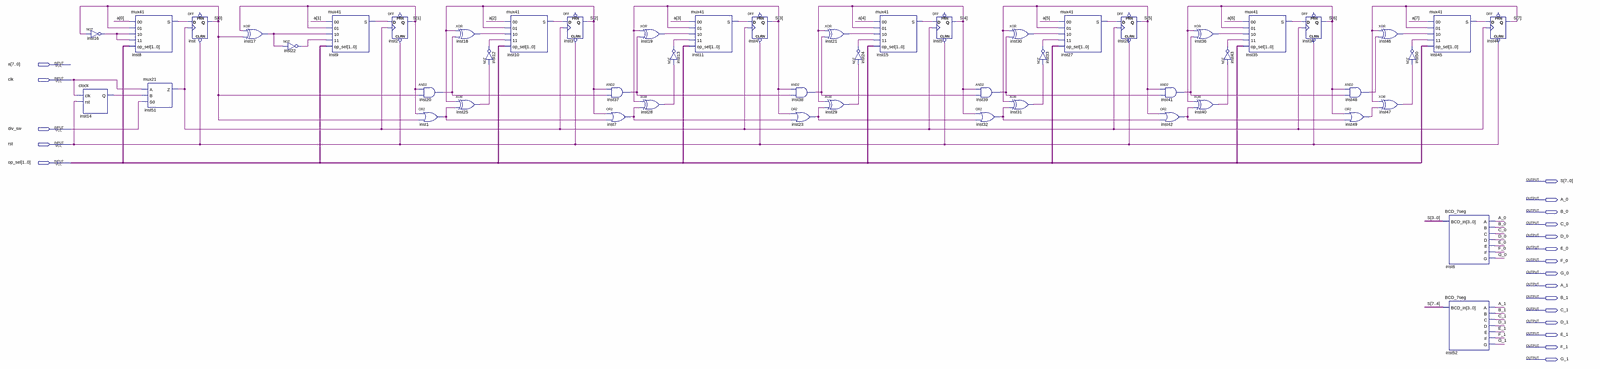
[diagram p0: schematic sheet, whole]
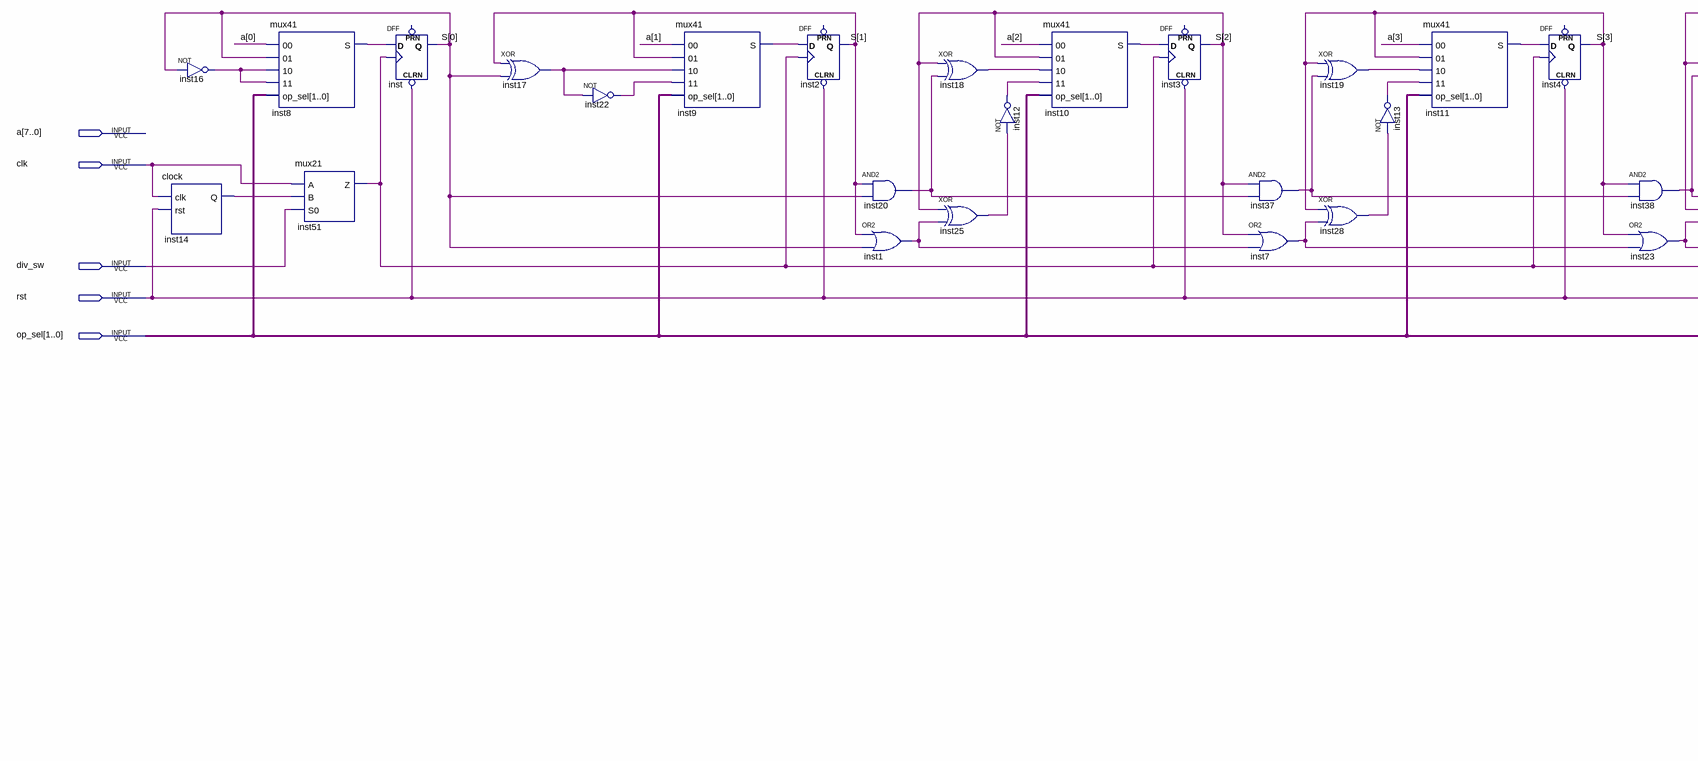
[diagram p1: schematic sheet, left part]
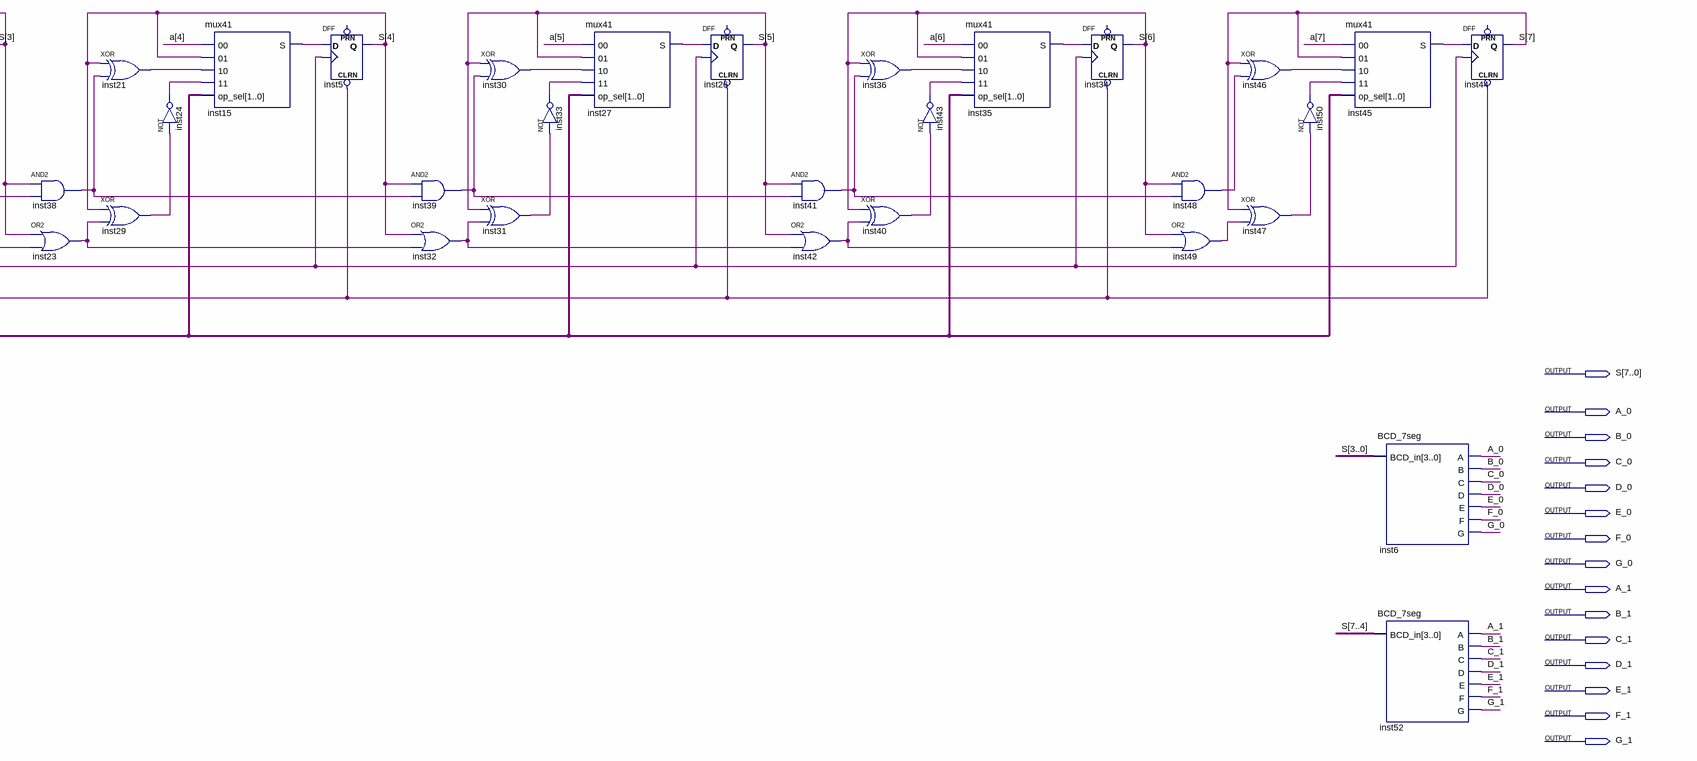
[diagram p2: schematic sheet, right part]
// Quartus schematic counter.bdf as structural Verilog: 53 symbols, 20 pins
module counter (
  input  [7:0] a,
  input  clk,
  input  div_sw,
  input  rst,
  input  [1:0] op_sel,
  output [7:0] S,
  output A_0,
  output B_0,
  output C_0,
  output D_0,
  output E_0,
  output F_0,
  output G_0,
  output A_1,
  output B_1,
  output C_1,
  output D_1,
  output E_1,
  output F_1,
  output G_1
);

  wire inst1_out, inst7_out, inst8_s, inst9_s, inst10_s, inst11_s, inst12_out, inst13_out, inst14_q,
       inst15_s, inst16_out, inst17_out, inst18_out, inst19_out, inst20_out, inst21_out, inst22_out,
       inst23_out, inst24_out, inst25_out, inst27_s, inst28_out, inst29_out, inst30_out, inst31_out,
       inst32_out, inst33_out, inst35_s, inst36_out, inst37_out, inst38_out, inst39_out, inst40_out,
       inst41_out, inst42_out, inst43_out, inst45_s, inst46_out, inst47_out, inst48_out, inst49_out,
       inst50_out, inst51_z;

  not inst16 (inst16_out, S[0]);
  clock inst14 (.clk(clk), .rst(rst), .Q(inst14_q));
  mux41 inst8 (.\00 (a[0]), .\01 (S[0]), .\10 (inst16_out), .\11 (inst16_out), .op_sel(op_sel), .S(inst8_s));
  mux21 inst51 (.A(clk), .B(inst14_q), .S0(div_sw), .Z(inst51_z));
  DFF inst (.CLRN(rst), .CLK(inst51_z), .D(inst8_s), .Q(S[0]));  // open: PRN
  xor inst17 (inst17_out, S[1], S[0]);
  not inst22 (inst22_out, inst17_out);
  mux41 inst9 (.\00 (a[1]), .\01 (S[1]), .\10 (inst17_out), .\11 (inst22_out), .op_sel(op_sel), .S(inst9_s));
  DFF inst2 (.CLRN(rst), .CLK(inst51_z), .D(inst9_s), .Q(S[1]));  // open: PRN
  and inst20 (inst20_out, S[1], S[0]);
  or inst1 (inst1_out, S[1], S[0]);
  xor inst18 (inst18_out, S[2], inst20_out);
  xor inst25 (inst25_out, S[2], inst1_out);
  mux41 inst10 (.\00 (a[2]), .\01 (S[2]), .\10 (inst18_out), .\11 (inst12_out), .op_sel(op_sel), .S(inst10_s));
  not inst12 (inst12_out, inst25_out);
  DFF inst3 (.CLRN(rst), .CLK(inst51_z), .D(inst10_s), .Q(S[2]));  // open: PRN
  and inst37 (inst37_out, S[2], inst20_out);
  or inst7 (inst7_out, S[2], inst1_out);
  xor inst19 (inst19_out, S[3], inst37_out);
  xor inst28 (inst28_out, S[3], inst7_out);
  not inst13 (inst13_out, inst28_out);
  mux41 inst11 (.\00 (a[3]), .\01 (S[3]), .\10 (inst19_out), .\11 (inst13_out), .op_sel(op_sel), .S(inst11_s));
  DFF inst4 (.CLRN(rst), .CLK(inst51_z), .D(inst11_s), .Q(S[3]));  // open: PRN
  and inst38 (inst38_out, S[3], inst37_out);
  or inst23 (inst23_out, S[3], inst7_out);
  xor inst21 (inst21_out, S[4], inst38_out);
  xor inst29 (inst29_out, S[4], inst23_out);
  mux41 inst15 (.\00 (a[4]), .\01 (S[4]), .\10 (inst21_out), .\11 (inst24_out), .op_sel(op_sel), .S(inst15_s));
  not inst24 (inst24_out, inst29_out);
  DFF inst5 (.CLRN(rst), .CLK(inst51_z), .D(inst15_s), .Q(S[4]));  // open: PRN
  and inst39 (inst39_out, S[4], inst38_out);
  or inst32 (inst32_out, S[4], inst23_out);
  xor inst30 (inst30_out, S[5], inst39_out);
  xor inst31 (inst31_out, S[5], inst32_out);
  not inst33 (inst33_out, inst31_out);
  mux41 inst27 (.\00 (a[5]), .\01 (S[5]), .\10 (inst30_out), .\11 (inst33_out), .op_sel(op_sel), .S(inst27_s));
  DFF inst26 (.CLRN(rst), .CLK(inst51_z), .D(inst27_s), .Q(S[5]));  // open: PRN
  and inst41 (inst41_out, S[5], inst39_out);
  or inst42 (inst42_out, S[5], inst32_out);
  xor inst36 (inst36_out, S[6], inst41_out);
  xor inst40 (inst40_out, S[6], inst42_out);
  mux41 inst35 (.\00 (a[6]), .\01 (S[6]), .\10 (inst36_out), .\11 (inst43_out), .op_sel(op_sel), .S(inst35_s));
  not inst43 (inst43_out, inst40_out);
  DFF inst34 (.CLRN(rst), .CLK(inst51_z), .D(inst35_s), .Q(S[6]));  // open: PRN
  and inst48 (inst48_out, S[6], inst41_out);
  or inst49 (inst49_out, S[6], inst42_out);
  xor inst46 (inst46_out, S[7], inst48_out);
  xor inst47 (inst47_out, S[7], inst49_out);
  not inst50 (inst50_out, inst47_out);
  mux41 inst45 (.\00 (a[7]), .\01 (S[7]), .\10 (inst46_out), .\11 (inst50_out), .op_sel(op_sel), .S(inst45_s));
  BCD_7seg inst6 (.BCD_in(S[3:0]), .A(A_0), .B(B_0), .C(C_0), .D(D_0), .E(E_0), .F(F_0), .G(G_0));
  BCD_7seg inst52 (.BCD_in(S[7:4]), .A(A_1), .B(B_1), .C(C_1), .D(D_1), .E(E_1), .F(F_1), .G(G_1));
  DFF inst44 (.CLRN(rst), .CLK(inst51_z), .D(inst45_s), .Q(S[7]));  // open: PRN
endmodule
